# Altium project IoT_Garden.PrjPcb
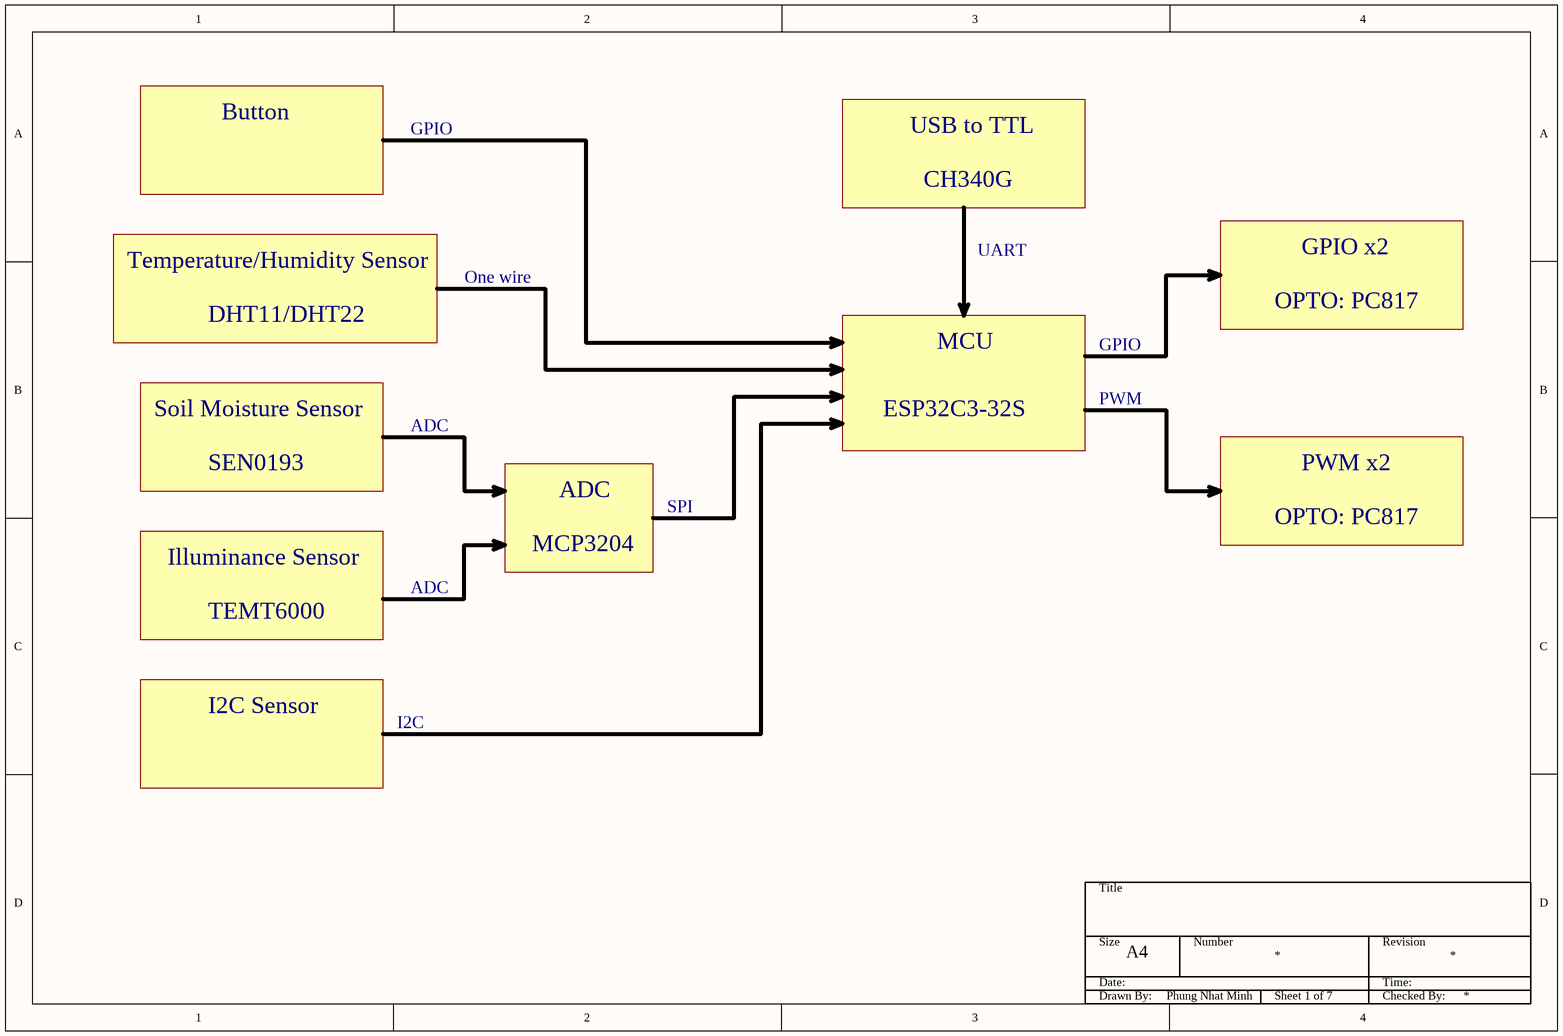
[diagram p0: SCH_01_Block_Diagram.SchDoc]
7 sheets, 73 parts. Net scope: global (net labels, ports and power ports of the same name join across sheets).
Board file: PCB_IoT_Garden_1.0.PcbDoc
Sheets:
  SCH_01_Block_Diagram.SchDoc
  SCH_02_Power_Diagram.SchDoc
  SCH_03_Power.SchDoc
  SCH_04_MCU.SchDoc
  SCH_05_USB_To_TTL.SchDoc
  SCH_06_Input.SchDoc
  SCH_07_Output.SchDoc

## Sheet SCH_01_Block_Diagram.SchDoc
size A4; DrawnBy: Phung Nhat Minh; SheetNumber: 1; SheetTotal: 7

### Notes on the sheet
- Button
- GPIO
- USB to TTL
- CH340G
- Temperature/Humidity Sensor
- One wire
- UART
- OPTO: PC817
- GPIO x2
- DHT11/DHT22
- MCU
- Soil Moisture Sensor
- ADC
- ESP32C3-32S
- PWM
- SEN0193
- SPI
- PWM x2
- Illuminance Sensor
- MCP3204
- TEMT6000
- I2C Sensor
- I2C
- Title
- Size
- Date:
- A4
- Number
- Revision
- Time:
- Drawn By:
- Checked By:

## Sheet SCH_02_Power_Diagram.SchDoc
size A4; DrawnBy: Phung Nhat Minh; SheetNumber: 2; SheetTotal: 7
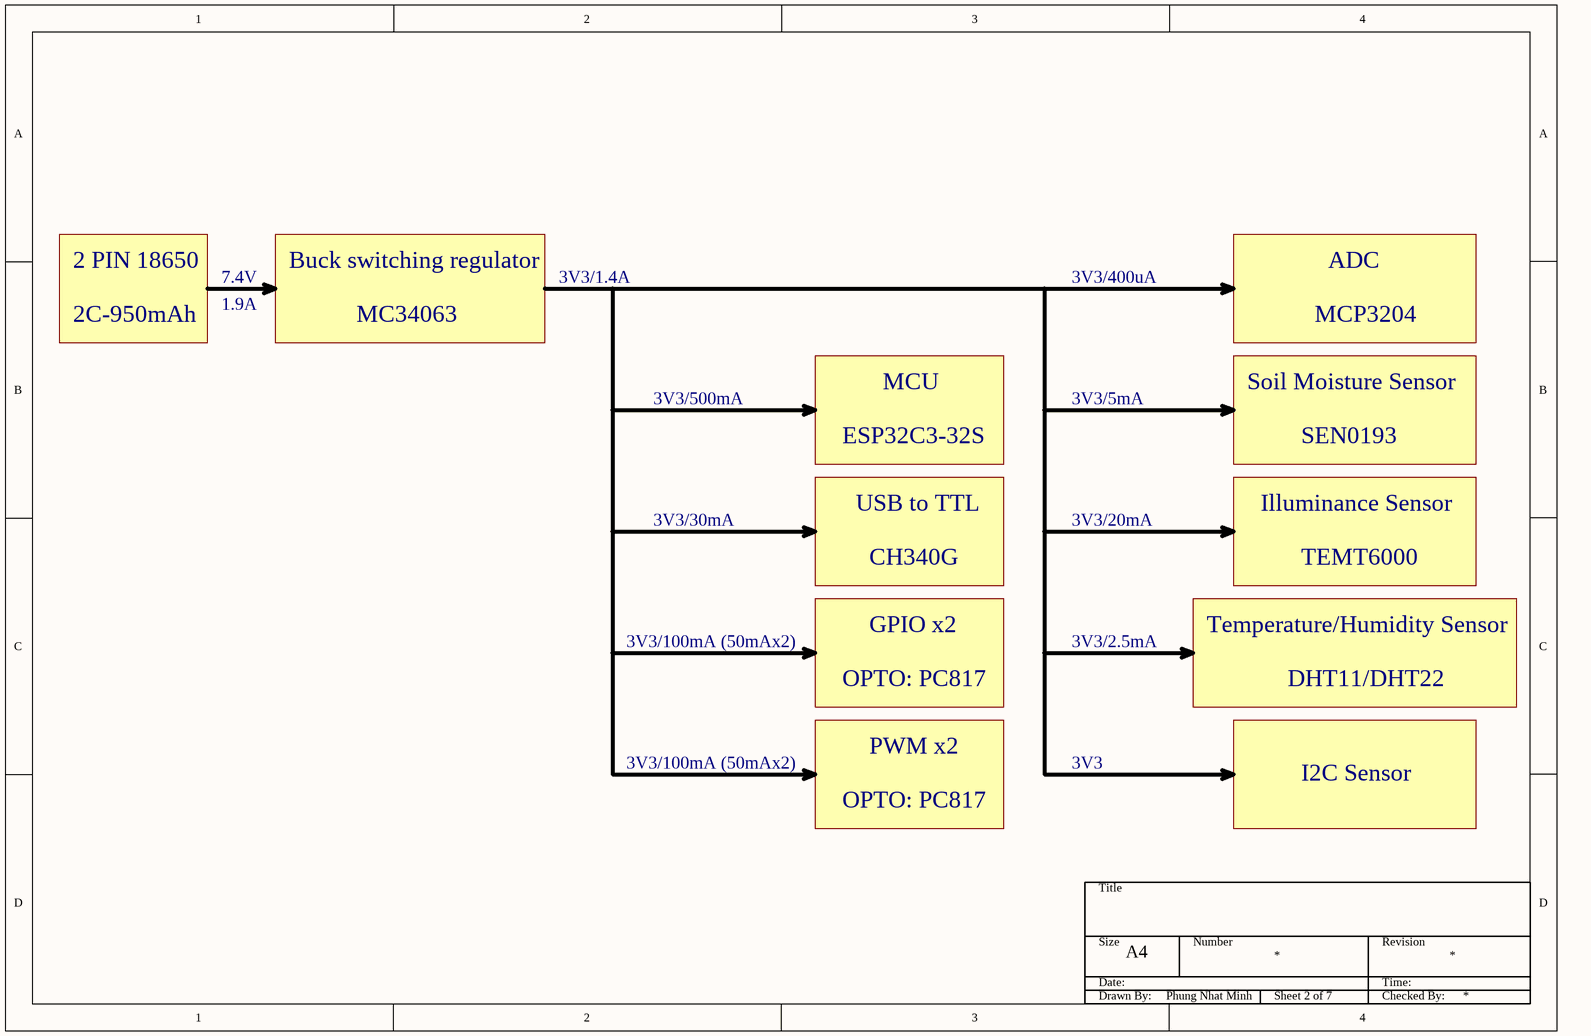
[diagram p1: SCH_02_Power_Diagram.SchDoc]

### Notes on the sheet
- 2 PIN 18650
- 7.4V
- 1.9A
- Buck switching regulator
- 3V3/1.4A
- 3V3/400uA
- ADC
- 2C-950mAh
- MC34063
- MCP3204
- 3V3/500mA
- ESP32C3-32S
- MCU
- 3V3/5mA
- Soil Moisture Sensor
- SEN0193
- USB to TTL
- Illuminance Sensor
- 3V3/30mA
- CH340G
- 3V3/20mA
- TEMT6000
- 3V3/100mA (50mAx2)
- GPIO x2
- 3V3/2.5mA
- Temperature/Humidity Sensor
- OPTO: PC817
- DHT11/DHT22
- PWM x2
- 3V3
- I2C Sensor
- Title
- Size
- Date:
- A4
- Number
- Revision
- Time:
- Drawn By:
- Checked By:

## Sheet SCH_03_Power.SchDoc
size A4; DrawnBy: Phung Nhat Minh; SheetNumber: 3; SheetTotal: 7
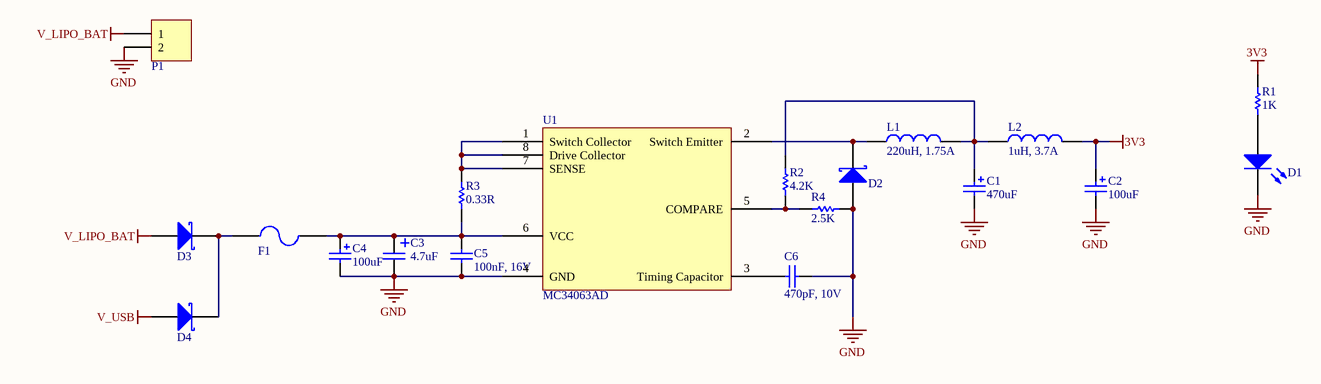
[diagram p2: SCH_03_Power.SchDoc]

### Parts
C1  value 470uF  [CAP ALU SIZE G]  (hidden comment: Cap Pol SMD)
C2  value 100uF  [CAP ALU SIZE D]  (hidden comment: Cap Pol SMD)
C3  value 4.7uF  [CAPMP3216X18N]  (hidden comment: Tantalum Capacitor)
C4  value 100uF  [CAP ALU SIZE D]  (hidden comment: Cap Pol SMD)
C5  100nF, 16V  [WCAP-CSGP_0805_H=0.8mm_Reflow]
C6  470pF, 10V  [WCAP-CSGP_0805_H=0.8mm_Reflow]
D1  LED SMD  [LED_0805_Blue]  (value not drawn)
D2  D Schottky  [SS34]  (value not drawn)
D3  D Schottky  [SS34]  (value not drawn)
D4  D Schottky  [SS34]  (value not drawn)
F1  Fuse  [FUSE SMD]  (value not drawn)
L1  220uH, 1.75A  [WE-PD2A_5848]
L2  1uH, 3.7A  [WE-PD2A_5848]
P1  Domino 2  [DOMINO 2- 5mm]  (value not drawn)
R1  value 1K  [RES-SM-0603]  (hidden comment: RESISTOR SMD)
R2  value 4.2K  [RES-SM-0805]  (hidden comment: RESISTOR SMD)
R3  value 0.33R  [RES-SM-0805]  (hidden comment: RESISTOR SMD)
R4  value 2.5K  [RES-SM-0805]  (hidden comment: RESISTOR SMD)
U1  MC34063AD  [SOIC127P600X170-8N]

### Nets
3V3: C2.1 L2.2 R1.2
GND: C1.2 C2.2 C3.2 C4.2 C5.1 C6.2 D1.2(K) D2.1(A) P1.2 R4.1 U1.4(GND)
V_LIPO_BAT: D3.1(A) P1.1
V_USB: D4.1(A)
NetC1_1: C1.1 L1.2 L2.1 R2.2
NetC3_1: C3.1 C4.1 C5.2 F1.2 R3.1 U1.6(VCC)
NetC6_1: C6.1 U1.3(Timing_Capacitor)
NetD1_1: D1.1(A) R1.1
NetD2_2: D2.2(K) L1.1 U1.2(Switch_Emitter)
NetD3_2: D3.2(K) D4.2(K) F1.1
NetR2_1: R2.1 R4.2 U1.5(COMPARE)
NetR3_2: R3.2 U1.1(Switch_Collector) U1.7(SENSE) U1.8(Drive_Collector)

### Notes on the sheet
- Title
- Size
- Date:
- A4
- Number
- Revision
- Time:
- Drawn By:
- Checked By:

### Library data of the parts
C1 C2 C4 = Cap Pol SMD: Polarized Capacitor (Radial)
C5 = 885012207045: WCAP-CSGP Multilayer Ceramic Chip Capacitor, General Purpose, size 0805, X7R, 100nF, 16V; Manufacturer: Wurth Elektronik; Rated Voltage: 16VDC; Isolation Resistance: >=5GOhm; Capacitance Tolerance: +/-10%; Technical Reference: X7R0805104K016DFCT10000; ComponentLink1Description: Manufacturer; ComponentLink1URL: http://www.we-online.de; ComponentLink2Description: Datasheet; ComponentLink2URL: https://www.we-online.com/catalog/datasheet/885012207045.pdf; Operating Temperature: -55 to +125degC; Packaging: Tape and Reel; Manufacturer Part Number: 885012207045; Published Date: May 2020; Ceramic Type: X7R; Dissipation Factor: =<3.5%; Height: 0.8mm; Mounting Technology: SMT; Size: 0805; Capacitance: 100nF
C6 = 885012207016: WCAP-CSGP Multilayer Ceramic Chip Capacitor, General Purpose, size 0805, X7R, 100nF, 10V; Manufacturer: Wurth Elektronik; Rated Voltage: 10VDC; Isolation Resistance: >=5GOhm; Capacitance Tolerance: +/-10%; Technical Reference: X7R0805104K010DFCT10000; ComponentLink1Description: Manufacturer; ComponentLink1URL: http://www.we-online.de; ComponentLink2Description: Datasheet; ComponentLink2URL: https://www.we-online.com/catalog/datasheet/885012207016.pdf; Operating Temperature: -55 to +125degC; Packaging: Tape and Reel; Manufacturer Part Number: 885012207016; Published Date: May 2020; Ceramic Type: X7R; Dissipation Factor: =<5%; Height: 0.8mm; Mounting Technology: SMT; Size: 0805; Capacitance: 100nF
D1 = LED SMD: LED
D2-D4 = D Schottky: Schottky Diode; Published: 8-Jun-2000; LatestRevisionDate: 17-Jul-2002; LatestRevisionNote: Re-released for DXP Platform.; PackageReference: SMB; Publisher: Altium Limited; PackageDescription: DO-214-AA/SMB; 2 C-Bend Leads; Body 5.3 x 3.6 mm, inc. leads (LxW); Code_JEDEC: DO-214-AA
L1 = 784774222: WE-PD2A SMT Power Inductor, size 5848, 220uH, 0.41A; Manufacturer: Wurth Elektronik; DC Resistance max.: 1.57Ohm; Saturation Current: 0.47A; Self Resonant Frequency: 5MHz; DC Resistance typ.: 0.945Ohm; Rated Voltage: 80VDC; ComponentLink1Description: Manufacturer; ComponentLink1URL: http://www.we-online.de; ComponentLink2Description: Datasheet; ComponentLink2URL: https://www.we-online.com/catalog/datasheet/784774222.pdf; Manufacturer Part Number: 784774222; Published Date: May 2020; Rated Current: 0.41A; Inductance: 220uH; Operating Temperature: -40 to +125degC; Mounting Technology: SMT; Packaging: Tape and Reel; Size: 5848
L2 = 784774003: WE-PD2A SMT Power Inductor, size 5848, 0.33uH, 10.8A; Manufacturer: Wurth Elektronik; DC Resistance max.: 0.008Ohm; Saturation Current: 15.3A; Self Resonant Frequency: 295MHz; DC Resistance typ.: 0.006Ohm; Rated Voltage: 80VDC; ComponentLink1Description: Manufacturer; ComponentLink1URL: http://www.we-online.de; ComponentLink2Description: Datasheet; ComponentLink2URL: https://www.we-online.com/catalog/datasheet/784774003.pdf; Manufacturer Part Number: 784774003; Published Date: May 2020; Rated Current: 10.8A; Inductance: 0.33uH; Operating Temperature: -40 to +125degC; Mounting Technology: SMT; Packaging: Tape and Reel; Size: 5848
P1 = Domino 2: Domino, 2-Pin; LatestRevisionDate: 17-Jul-2002; LatestRevisionNote: Re-released for DXP Platform.; Publisher: Altium Limited
R1-R4 = RESISTOR SMD: Resistor
U1 = MC34063: 1.5-A boost, buck, inverting switching regulator, operation from 0°C to 70°C; Manufacturer: Texas Instruments; ComponentLink1Description: Local Supplier Link; ComponentLink1URL: https://www.thegioiic.com/products/mc34063ad-ic-dieu-chinh-tang-giam-ap-1-5a-8-soic; Local Supplier: Thegioiic; Local Supplier P/N: MC34063AD; Manufacturer P/N: MC34063AD

## Sheet SCH_04_MCU.SchDoc
size A4; DrawnBy: Phung Nhat Minh; SheetNumber: 4; SheetTotal: 7
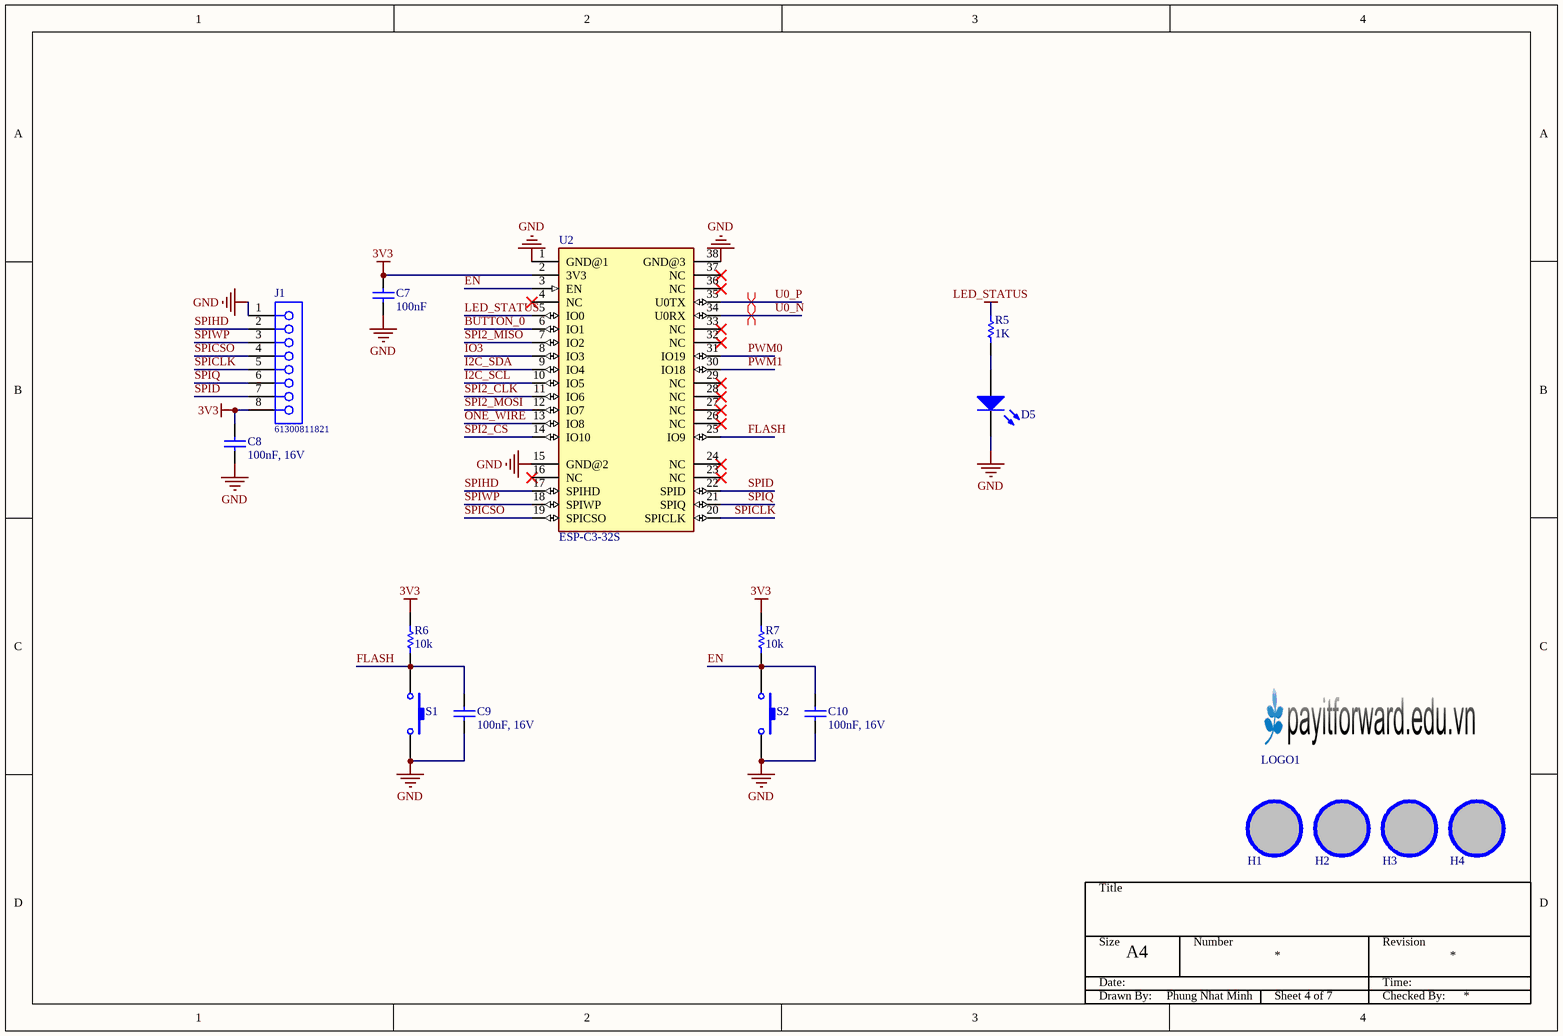
[diagram p3: SCH_04_MCU.SchDoc]

### Parts
C7  100nF  [WCAP-CSGP_0603_H=0.8mm_Reflow]
C8  100nF, 16V  [WCAP-CSGP_0603_H=0.8mm_Reflow]
C9  100nF, 16V  [WCAP-CSGP_0603_H=0.8mm_Reflow]
C10  100nF, 16V  [WCAP-CSGP_0603_H=0.8mm_Reflow]
D5  LED SMD  [LED_0805_Blue]  (value not drawn)
H1  Hole  [LO KHOAN 3MM]  (value not drawn)
H2  Hole  [LO KHOAN 3MM]  (value not drawn)
H3  Hole  [LO KHOAN 3MM]  (value not drawn)
H4  Hole  [LO KHOAN 3MM]  (value not drawn)
J1  61300811821  [61300811821]
LOGO1  LOGO PIF  [PIF LOGO BIG SSTOP]  (value not drawn)
R5  value 1K  [RES-SM-0603]  (hidden comment: RESISTOR SMD)
R6  value 10k  [RES-SM-0603]  (hidden comment: RESISTOR SMD)
R7  value 10k  [RES-SM-0603]  (hidden comment: RESISTOR SMD)
S1  Tact SW - 2Pin  [SW-SMD]  (value not drawn)
S2  Tact SW - 2Pin  [SW-SMD]  (value not drawn)
U2  ESP-C3-32S  [ESP-32S]

### Nets
3V3: C7.2 C8.2 J1.8 R6.1 R7.1 U2.2(3V3)
GND: C7.1 C8.1 C9.1 C10.1 D5.2(K) J1.1 S1.2 S2.2 U2.1(GND@1) U2.15(GND@2) U2.38(GND@3)
LED_STATUS: R5.2 U2.5(IO0)
BUTTON_0: U2.6(IO1)
EN: C10.2 R7.2 S2.1 U2.3(EN)
FLASH: C9.2 R6.2 S1.1 U2.25(IO9)
I2C_SCL: U2.10(IO5)
I2C_SDA: U2.9(IO4)
IO3: U2.8(IO3)
ONE_WIRE: U2.13(IO8)
PWM0: U2.31(IO19)
PWM1: U2.30(IO18)
SPI2_CLK: U2.11(IO6)
SPI2_CS: U2.14(IO10)
SPI2_MISO: U2.7(IO2)
SPI2_MOSI: U2.12(IO7)
SPICLK: J1.5 U2.20(SPICLK)
SPICSO: J1.4 U2.19(SPICSO)
SPID: J1.7 U2.22(SPID)
SPIHD: J1.2 U2.17(SPIHD)
SPIQ: J1.6 U2.21(SPIQ)
SPIWP: J1.3 U2.18(SPIWP)
U0_N: U2.34(U0RX)
U0_P: U2.35(U0TX)
NetD5_1: D5.1(A) R5.1

Not connected (* = marked no-connect by the designer): H1 1; H2 1; H3 1; H4 1; U2 4(NC)* 16(NC)* 23(NC)* 24(NC)* 26(NC)* 27(NC)* 28(NC)* 29(NC)* 32(NC)* 33(NC)* 36(NC)* 37(NC)*

### Layout directives
differential pair: U0_N, U0_P

### Notes on the sheet
- Title
- Size
- Date:
- A4
- Number
- Revision
- Time:
- Drawn By:
- Checked By:

### Library data of the parts
C7-C10 = 885012206046: WCAP-CSGP Multilayer Ceramic Chip Capacitor, General Purpose, size 0603, X7R, 100nF, 16V; Manufacturer: Wurth Elektronik; Rated Voltage: 16VDC; Isolation Resistance: >=5GOhm; Capacitance Tolerance: +/-10%; Technical Reference: X7R0603104K016DFCT10000; ComponentLink1Description: Manufacturer; ComponentLink1URL: http://www.we-online.de; ComponentLink2Description: Datasheet; ComponentLink2URL: https://www.we-online.com/catalog/datasheet/885012206046.pdf; Operating Temperature: -55 to +125degC; Packaging: Tape and Reel; Manufacturer Part Number: 885012206046; Published Date: May 2020; Ceramic Type: X7R; Dissipation Factor: =<3.5%; Height: 0.8mm; Mounting Technology: SMT; Size: 0603; Capacitance: 100nF
D5 = LED SMD: LED
H1-H4 = Hole: Hole 3mm
J1 = 61300811821: WR-PHD Socket Header, THT, pitch 2.54mm, Single Row, Vertical, 8p; Manufacturer: Wurth Elektronik; Pin Number: 8; Rated Current: 3A; Working Voltage: 250VAC; Withstanding Voltage: 500VAC; Contact Resistance: 20mOhm; ComponentLink1Description: Manufacturer; ComponentLink1URL: http://www.we-online.de; ComponentLink2Description: Datasheet; ComponentLink2URL: https://www.we-online.com/catalog/datasheet/61300811821.pdf; Manufacturer Part Number: 61300811821; Published Date: May 2020; Pitch: 2.54mm; Operating Temperature: -40 to +125degC; Mounting Technology: THT; Packaging: Tray; Gender: Socket Header; Row Number: Single; Orientation: Vertical
R5-R7 = RESISTOR SMD: Resistor
S1 S2 = Tact SW - 2Pin: Switch button 2 pin
U2 = ESP-C3-32S: - - Transceiver Module - - Surface Mount; MF: Olimex LTD; MP: ESP-32S; Package: None; Availability: Not in stock; Price: None; SnapEDA_Link: https://www.snapeda.com/parts/ESP-32S/Olimex+LTD/view-part/?ref=snap; Check_prices: https://www.snapeda.com/parts/ESP-32S/Olimex+LTD/view-part/?ref=eda; Value: *

## Sheet SCH_05_USB_To_TTL.SchDoc
size A4; DrawnBy: Phung Nhat Minh; SheetNumber: 5; SheetTotal: 7
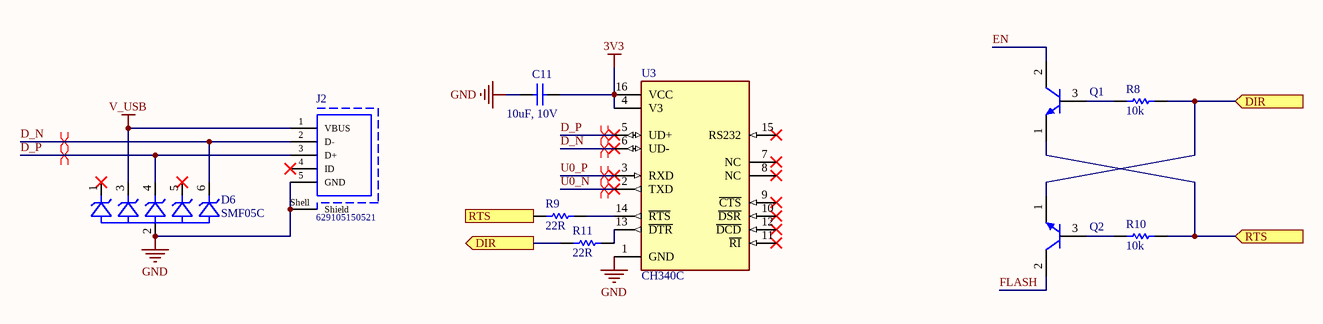
[diagram p4: SCH_05_USB_To_TTL.SchDoc]

### Parts
C11  10uF, 10V  [WCAP-CSGP_0603_H=0.8mm_Reflow]
D6  SMF05C  [SC70-6]
J2  629105150521  [629105150521]
Q1  C1815  [SOT23B]  (value not drawn)
Q2  C1815  [SOT23B]  (value not drawn)
R8  value 10k  [RES-SM-0603]  (hidden comment: RESISTOR SMD)
R9  value 22R  [RES-SM-0603]  (hidden comment: RESISTOR SMD)
R10  value 10k  [RES-SM-0603]  (hidden comment: RESISTOR SMD)
R11  value 22R  [RES-SM-0603]  (hidden comment: RESISTOR SMD)
U3  CH340C  [SOIC127P600X180-16N]

### Ports
DIR (in, see SCH_05_USB_To_TTL[2C]), DIR (out, see SCH_05_USB_To_TTL[4B]), RTS (in, see SCH_05_USB_To_TTL[2C]), RTS (out, see SCH_05_USB_To_TTL[4C])

### Nets
3V3: C11.2 U3.4(V3) U3.16(VCC)
GND: C11.1 D6.2(A) J2.5(GND) J2.Shell(Shield) U3.1(GND)
V_USB: D6.3(C2) J2.1(VBUS)
D_N: D6.6(C5) J2.2(D-) U3.6(UD-)
D_P: D6.4(C3) J2.3(D+) U3.5(UD+)
EN: Q1.2(C)
FLASH: Q2.2(C)
U0_N: U3.2(TXD)
U0_P: U3.3(RXD)
NetQ1_1: Q1.1(E) R9.1 R10.2 ; port RTS
NetQ1_3: Q1.3(B) R8.1
NetQ2_1: Q2.1(E) R8.2 R11.1 ; port DIR
NetQ2_3: Q2.3(B) R10.1
NetR9_2: R9.2 U3.14(~{RTS})
NetR11_2: R11.2 U3.13(~{DTR})

Not connected (* = marked no-connect by the designer): D6 1(C1)* 5(C4)*; J2 4(ID)*; U3 7(NC)* 8(NC)* 9(~{CTS})* 10(~{DSR})* 11(~{RI})* 12(~{DCD})* 15(RS232)*

### Layout directives
differential pair: D_N, D_P, U0_N, U0_P

### Notes on the sheet
- Title
- Size
- Date:
- A4
- Number
- Revision
- Time:
- Drawn By:
- Checked By:

### Library data of the parts
C11 = 885012206020: WCAP-CSGP Multilayer Ceramic Chip Capacitor, General Purpose, size 0603, X7R, 100nF, 10V; Manufacturer: Wurth Elektronik; Rated Voltage: 10VDC; Isolation Resistance: >=5GOhm; Capacitance Tolerance: +/-10%; Technical Reference: X7R0603104K010DFCT10000; ComponentLink1Description: Manufacturer; ComponentLink1URL: http://www.we-online.de; ComponentLink2Description: Datasheet; ComponentLink2URL: https://www.we-online.com/catalog/datasheet/885012206020.pdf; Operating Temperature: -55 to +125degC; Packaging: Tape and Reel; Manufacturer Part Number: 885012206020; Published Date: May 2020; Ceramic Type: X7R; Dissipation Factor: =<5%; Height: 0.8mm; Mounting Technology: SMT; Size: 0603; Capacitance: 100nF
D6 = SMF05C: 12.5V Clamp 8A (8/20Âµs) Ipp Tvs Diode Surface Mount SC-88/SC70-6/SOT-363; MF: ProTek Devices; Price: None; Availability: In Stock; MP: SMF05C; Package: TSSOP-6 ProTek Devices; SnapEDA_Link: https://www.snapeda.com/parts/SMF05C/Protek+Devices/view-part/?ref=snap; Check_prices: https://www.snapeda.com/parts/SMF05C/Protek+Devices/view-part/?ref=eda; Value: *
J2 = 629105150521: Micro USB 2.0 Type B Receptacle WR-COM, Horizontal, SMT, with Pegs, High Current at Pin 1 & Pin 5; Rated Current: 3 A; Contact Resistance: 30 mOhm; Working Voltage: 30 VAC; ComponentLink1Description: Manufacturer; ComponentLink1URL: http://www.we-online.de; ComponentLink2Description: Datasheet; ComponentLink2URL: https://katalog.we-online.de/em/datasheet/629105150521.pdf; Part Number: 629105150521; Published Date: September 2018; Publisher: Wurth Elektronik; Orientation: Horizontal; Connector Type: Micro USB 2.0 Type B; Operating Temperature: -40 to 85 degC; Mounting Technology: SMT; Gender: Receptacle; Packaging: Tape and Reel
Q1 Q2 = C1815: NPN Bipolar Transistor
R8-R11 = RESISTOR SMD: Resistor

## Sheet SCH_06_Input.SchDoc
size A4; DrawnBy: Phung Nhat Minh; SheetNumber: 6; SheetTotal: 7; SPICEModelCacheHRPQVLRP: <root> / <DocumentId>HRPQVLRP</DocumentId> / </root>
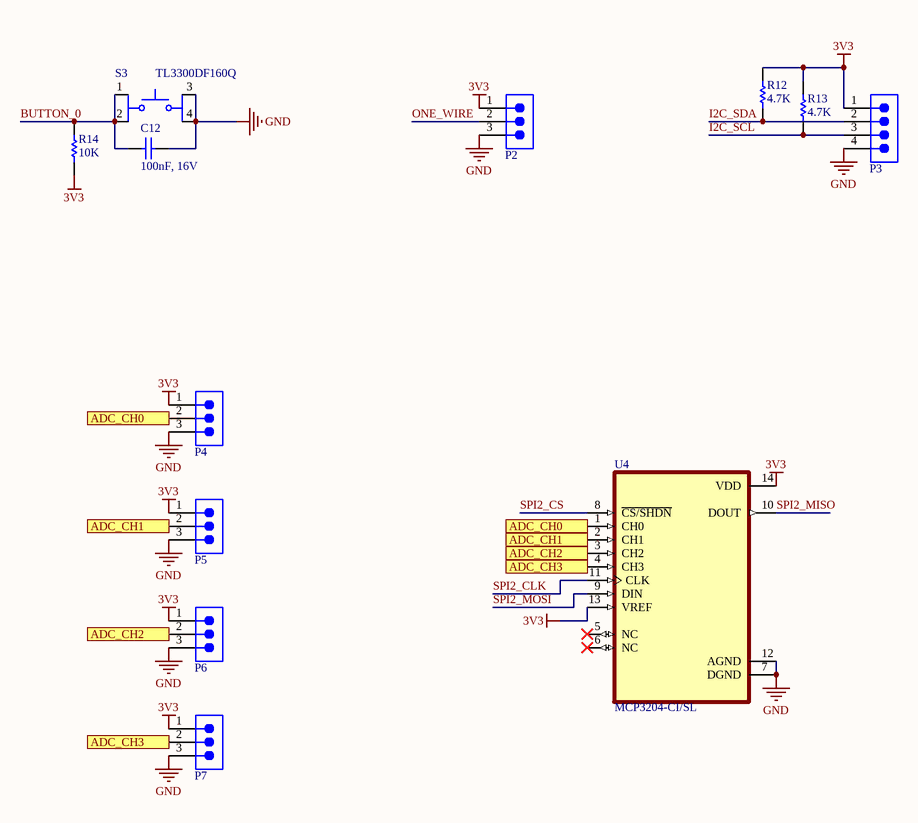
[diagram p5: SCH_06_Input.SchDoc]

### Parts
C12  100nF, 16V  [WCAP-CSGP_0603_H=0.8mm_Reflow]
P2  691312510003  [691312510003]  (value not drawn)
P3  691312510004  [691312510004]  (value not drawn)
P4  691312510003  [691312510003]  (value not drawn)
P5  691312510003  [691312510003]  (value not drawn)
P6  691312510003  [691312510003]  (value not drawn)
P7  691312510003  [691312510003]  (value not drawn)
R12  value 4.7K  [RES-SM-0603]  (hidden comment: RESISTOR SMD)
R13  value 4.7K  [RES-SM-0603]  (hidden comment: RESISTOR SMD)
R14  value 10K  [RES-SM-0603]  (hidden comment: RESISTOR SMD)
S3  TL3300DF160Q  [SW_TL3300DF160Q]
U4  MCP3204-CI/SL  [SOIC127P600X175-14N]

### Ports
ADC_CH0 (in, see SCH_06_Input[1C]), ADC_CH0 (out, see SCH_06_Input[2C]), ADC_CH1 (in, see SCH_06_Input[1C]), ADC_CH1 (out, see SCH_06_Input[2C]), ADC_CH2 (in, see SCH_06_Input[1C]), ADC_CH2 (out, see SCH_06_Input[2C]), ADC_CH3 (in, see SCH_06_Input[1D]), ADC_CH3 (out, see SCH_06_Input[2C])

### Nets
3V3: P2.1 P3.1 P4.1 P5.1 P6.1 P7.1 R12.2 R13.2 R14.2 U4.13(VREF) U4.14(VDD)
GND: C12.1 P2.3 P3.4 P4.3 P5.3 P6.3 P7.3 S3.3 S3.4 U4.7(DGND) U4.12(AGND)
BUTTON_0: C12.2 R14.1 S3.1 S3.2
I2C_SCL: P3.3 R13.1
I2C_SDA: P3.2 R12.1
ONE_WIRE: P2.2
SPI2_CLK: U4.11(CLK)
SPI2_CS: U4.8(~{CS/SHDN})
SPI2_MISO: U4.10(DOUT)
SPI2_MOSI: U4.9(DIN)
NetP4_2: P4.2 U4.1(CH0) ; port ADC_CH0
NetP5_2: P5.2 U4.2(CH1) ; port ADC_CH1
NetP6_2: P6.2 U4.3(CH2) ; port ADC_CH2
NetP7_2: P7.2 U4.4(CH3) ; port ADC_CH3

Not connected (* = marked no-connect by the designer): U4 5(NC)* 6(NC)*

### Notes on the sheet
- Title
- Size
- Date:
- A4
- Number
- Revision
- Time:
- Drawn By:
- Checked By:

### Library data of the parts
C12 = 885012206046: as C7 on sheet SCH_04_MCU; ComponentLink1Description: Manufacturer; ComponentLink1URL: http://www.we-online.de; ComponentLink2Description: Datasheet; ComponentLink2URL: https://www.we-online.com/catalog/datasheet/885012206046.pdf; Operating Temperature: -55 to +125degC; Packaging: Tape and Reel; Manufacturer Part Number: 885012206046; Published Date: May 2020; Ceramic Type: X7R; Dissipation Factor: =<3.5%; Height: 0.8mm; Mounting Technology: SMT; Size: 0603; Capacitance: 100nF
P2 P4-P7 = 691312510003: WR-TBL Series 312 Open Horizontal PCB Header, THT, pitch 5.08mm, 3p; Manufacturer: Wurth Elektronik; Modularity: No; Rated Current: 20A; Working Voltage: 300V; ComponentLink1Description: Website Link; ComponentLink1URL: https://www.we-online.com/redexpert/article/691312510003?ad; ComponentLink2Description: Datasheet Link; ComponentLink2URL: https://www.we-online.com/redexpert/spec/691312510003?ad; Manufacturer Part Number: 691312510003; Category: Terminal Blocks; Match Code: WR-TBL; Mount: Through Hole; Operating Temperature Max: 105°C; Operating Temperature Min: -40°C; Packaging: Box; Application: Pluggable; Number of Pins: 3; Number of Rows: 1; Orientation: Horizontal; Pitch: 5.08mm
P3 = 691312510004: WR-TBL Series 312 Open Horizontal PCB Header, THT, pitch 5.08mm, 4p; Manufacturer: Wurth Elektronik; Modularity: No; Rated Current: 20A; Working Voltage: 300V; ComponentLink1Description: Website Link; ComponentLink1URL: https://www.we-online.com/redexpert/article/691312510004?ad; ComponentLink2Description: Datasheet Link; ComponentLink2URL: https://www.we-online.com/redexpert/spec/691312510004?ad; Manufacturer Part Number: 691312510004; Category: Terminal Blocks; Match Code: WR-TBL; Mount: Through Hole; Operating Temperature Max: 105°C; Operating Temperature Min: -40°C; Packaging: Box; Application: Pluggable; Number of Pins: 4; Number of Rows: 1; Orientation: Horizontal; Pitch: 5.08mm
R12-R14 = RESISTOR SMD: Resistor
U4 = MCP3204-CI/SL: 12 Bit Analog to Digital Converter 2, 4 Input 1 SAR 14-SOIC; MF: Microchip; Check_prices: https://www.snapeda.com/parts/MCP3204-CI/SL/Microchip/view-part/?ref=eda; Value: *; Availability: In Stock; MP: MCP3204-CI/SL; Price: None; Package: SOIC-14 Microchip; SnapEDA_Link: https://www.snapeda.com/parts/MCP3204-CI/SL/Microchip/view-part/?ref=snap; Purchase-URL: https://pricing.snapeda.com/search/part/MCP3204-CI/SL/?ref=eda
S3 = TL3300DF160Q: Price: None; MP: TL3300DF160Q; Availability: Unavailable; Package: None; Value: *

## Sheet SCH_07_Output.SchDoc
size A4; DrawnBy: Phung Nhat Minh; SheetNumber: 7; SheetTotal: 7
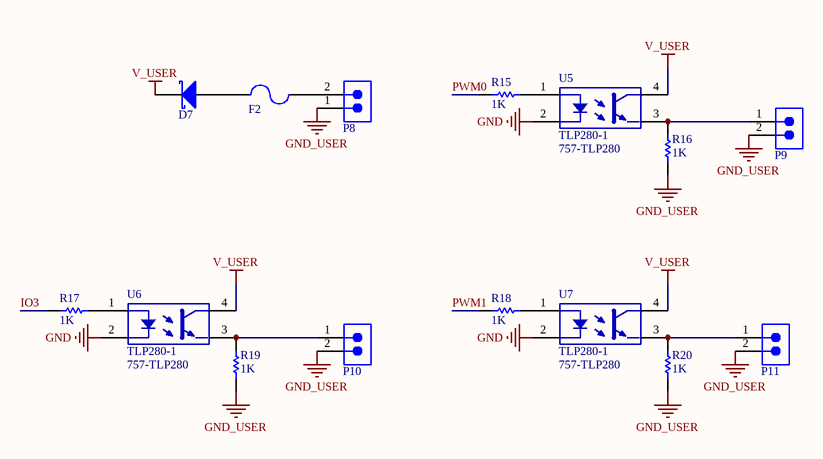
[diagram p6: SCH_07_Output.SchDoc]

### Parts
D7  D Schottky  [SS34]  (value not drawn)
F2  Fuse  [FUSE SMD]  (value not drawn)
P8  691312510002  [691312510002]  (value not drawn)
P9  691312510002  [691312510002]  (value not drawn)
P10  691312510002  [691312510002]  (value not drawn)
P11  691312510002  [691312510002]  (value not drawn)
R15  value 1K  [RES-SM-0603]  (hidden comment: RESISTOR SMD)
R16  value 1K  [RES-SM-0603]  (hidden comment: RESISTOR SMD)
R17  value 1K  [RES-SM-0603]  (hidden comment: RESISTOR SMD)
R18  value 1K  [RES-SM-0603]  (hidden comment: RESISTOR SMD)
R19  value 1K  [RES-SM-0603]  (hidden comment: RESISTOR SMD)
R20  value 1K  [RES-SM-0603]  (hidden comment: RESISTOR SMD)
U5  TLP280-1  Supplier Part Number 1: 757-TLP280  [SOIC127P700X240-4N]
U6  TLP280-1  Supplier Part Number 1: 757-TLP280  [SOIC127P700X240-4N]
U7  TLP280-1  Supplier Part Number 1: 757-TLP280  [SOIC127P700X240-4N]

### Nets
GND: U5.2 U6.2 U7.2
GND_USER: P8.1 P9.2 P10.2 P11.2 R16.1 R19.1 R20.1
V_USER: D7.2(K) U5.4 U6.4 U7.4
IO3: R17.2
PWM0: R15.2
PWM1: R18.2
NetD7_1: D7.1(A) F2.1
NetF2_2: F2.2 P8.2
NetP9_1: P9.1 R16.2 U5.3
NetP10_1: P10.1 R19.2 U6.3
NetP11_1: P11.1 R20.2 U7.3
NetR15_1: R15.1 U5.1
NetR17_1: R17.1 U6.1
NetR18_1: R18.1 U7.1

### Notes on the sheet
- Title
- Size
- Date:
- A4
- Number
- Revision
- Time:
- Drawn By:
- Checked By:

### Library data of the parts
D7 = D Schottky: Schottky Diode; Published: 8-Jun-2000; LatestRevisionDate: 17-Jul-2002; LatestRevisionNote: Re-released for DXP Platform.; PackageReference: SMB; Publisher: Altium Limited; PackageDescription: DO-214-AA/SMB; 2 C-Bend Leads; Body 5.3 x 3.6 mm, inc. leads (LxW); Code_JEDEC: DO-214-AA
P8-P11 = 691312510002: WR-TBL Series 312 Open Horizontal PCB Header, THT, pitch 5.08mm, 2p; Manufacturer: Wurth Elektronik; Modularity: No; Rated Current: 20A; Working Voltage: 300V; ComponentLink1Description: Website Link; ComponentLink1URL: https://www.we-online.com/redexpert/article/691312510002?ad; ComponentLink2Description: Datasheet Link; ComponentLink2URL: https://www.we-online.com/redexpert/spec/691312510002?ad; Manufacturer Part Number: 691312510002; Category: Terminal Blocks; Match Code: WR-TBL; Mount: Through Hole; Operating Temperature Max: 105°C; Operating Temperature Min: -40°C; Packaging: Box; Application: Pluggable; Number of Pins: 2; Number of Rows: 1; Orientation: Horizontal; Pitch: 5.08mm
R15-R20 = RESISTOR SMD: Resistor
U5-U7 = TLP280-1: Transistor Output Optocouplers 80Vceo 2500Vrms AC input; Supplier 1: Mouser

## Nets that join several sheets
3V3: SCH_03_Power (C2.1 L2.2 R1.2), SCH_04_MCU (6 pins), SCH_05_USB_To_TTL (C11.2 U3.4 U3.16), SCH_06_Input (11 pins)
GND: SCH_03_Power (11 pins), SCH_04_MCU (11 pins), SCH_05_USB_To_TTL (5 pins), SCH_06_Input (11 pins), SCH_07_Output (U5.2 U6.2 U7.2)
V_USB: SCH_03_Power (D4.1), SCH_05_USB_To_TTL (D6.3 J2.1)
BUTTON_0: SCH_04_MCU (U2.6), SCH_06_Input (C12.2 R14.1 S3.1 S3.2)
EN: SCH_04_MCU (C10.2 R7.2 S2.1 U2.3), SCH_05_USB_To_TTL (Q1.2)
FLASH: SCH_04_MCU (C9.2 R6.2 S1.1 U2.25), SCH_05_USB_To_TTL (Q2.2)
I2C_SCL: SCH_04_MCU (U2.10), SCH_06_Input (P3.3 R13.1)
I2C_SDA: SCH_04_MCU (U2.9), SCH_06_Input (P3.2 R12.1)
IO3: SCH_04_MCU (U2.8), SCH_07_Output (R17.2)
ONE_WIRE: SCH_04_MCU (U2.13), SCH_06_Input (P2.2)
PWM0: SCH_04_MCU (U2.31), SCH_07_Output (R15.2)
PWM1: SCH_04_MCU (U2.30), SCH_07_Output (R18.2)
SPI2_CLK: SCH_04_MCU (U2.11), SCH_06_Input (U4.11)
SPI2_CS: SCH_04_MCU (U2.14), SCH_06_Input (U4.8)
SPI2_MISO: SCH_04_MCU (U2.7), SCH_06_Input (U4.10)
SPI2_MOSI: SCH_04_MCU (U2.12), SCH_06_Input (U4.9)
U0_N: SCH_04_MCU (U2.34), SCH_05_USB_To_TTL (U3.2)
U0_P: SCH_04_MCU (U2.35), SCH_05_USB_To_TTL (U3.3)